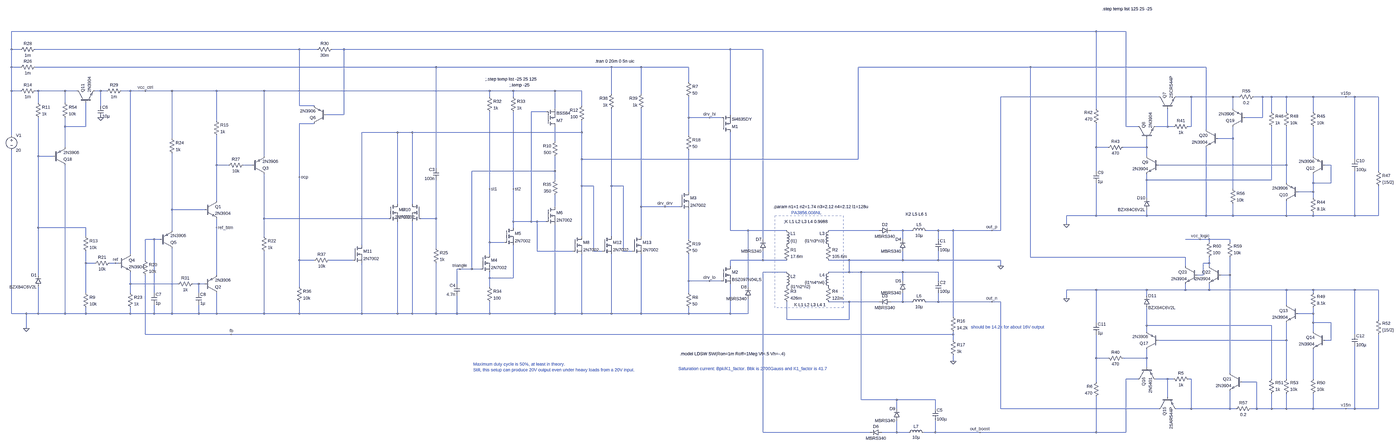
[diagram p0: schematic forward_regulator_1.asc, whole sheet]
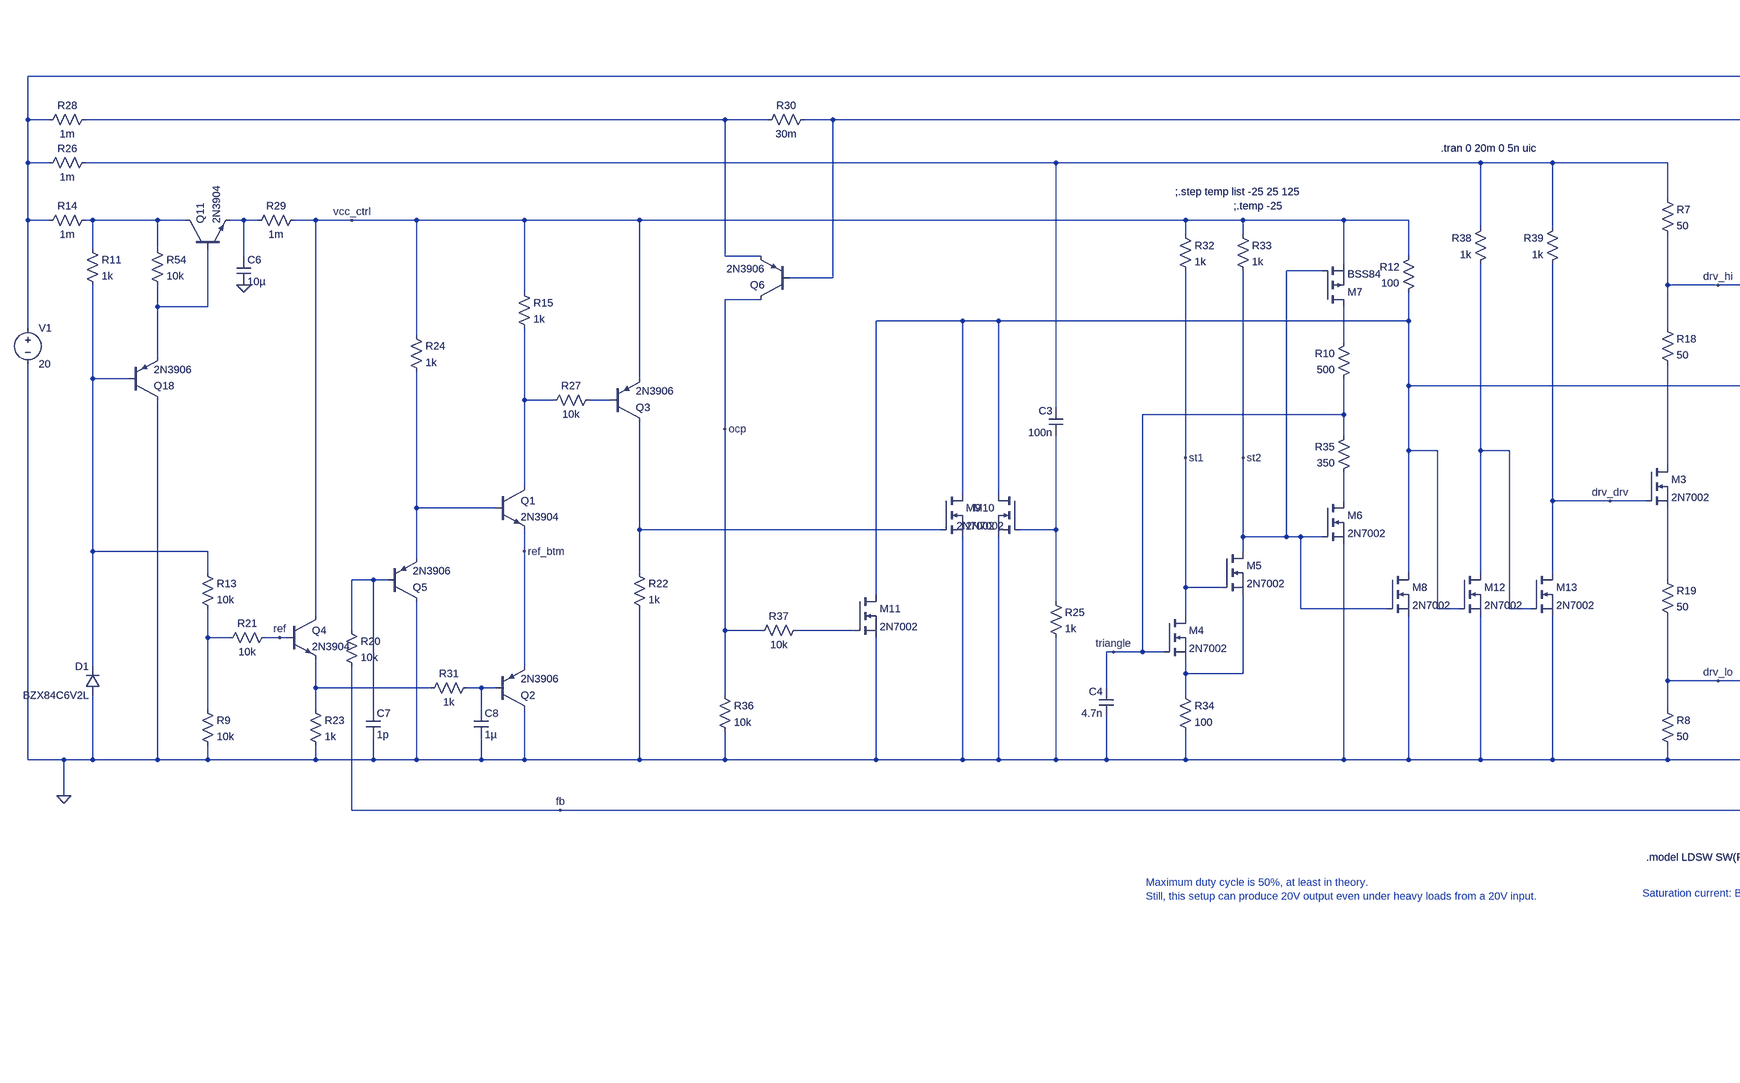
[diagram p1: schematic forward_regulator_1.asc, part, row 1 of 1, column 1 of 2]
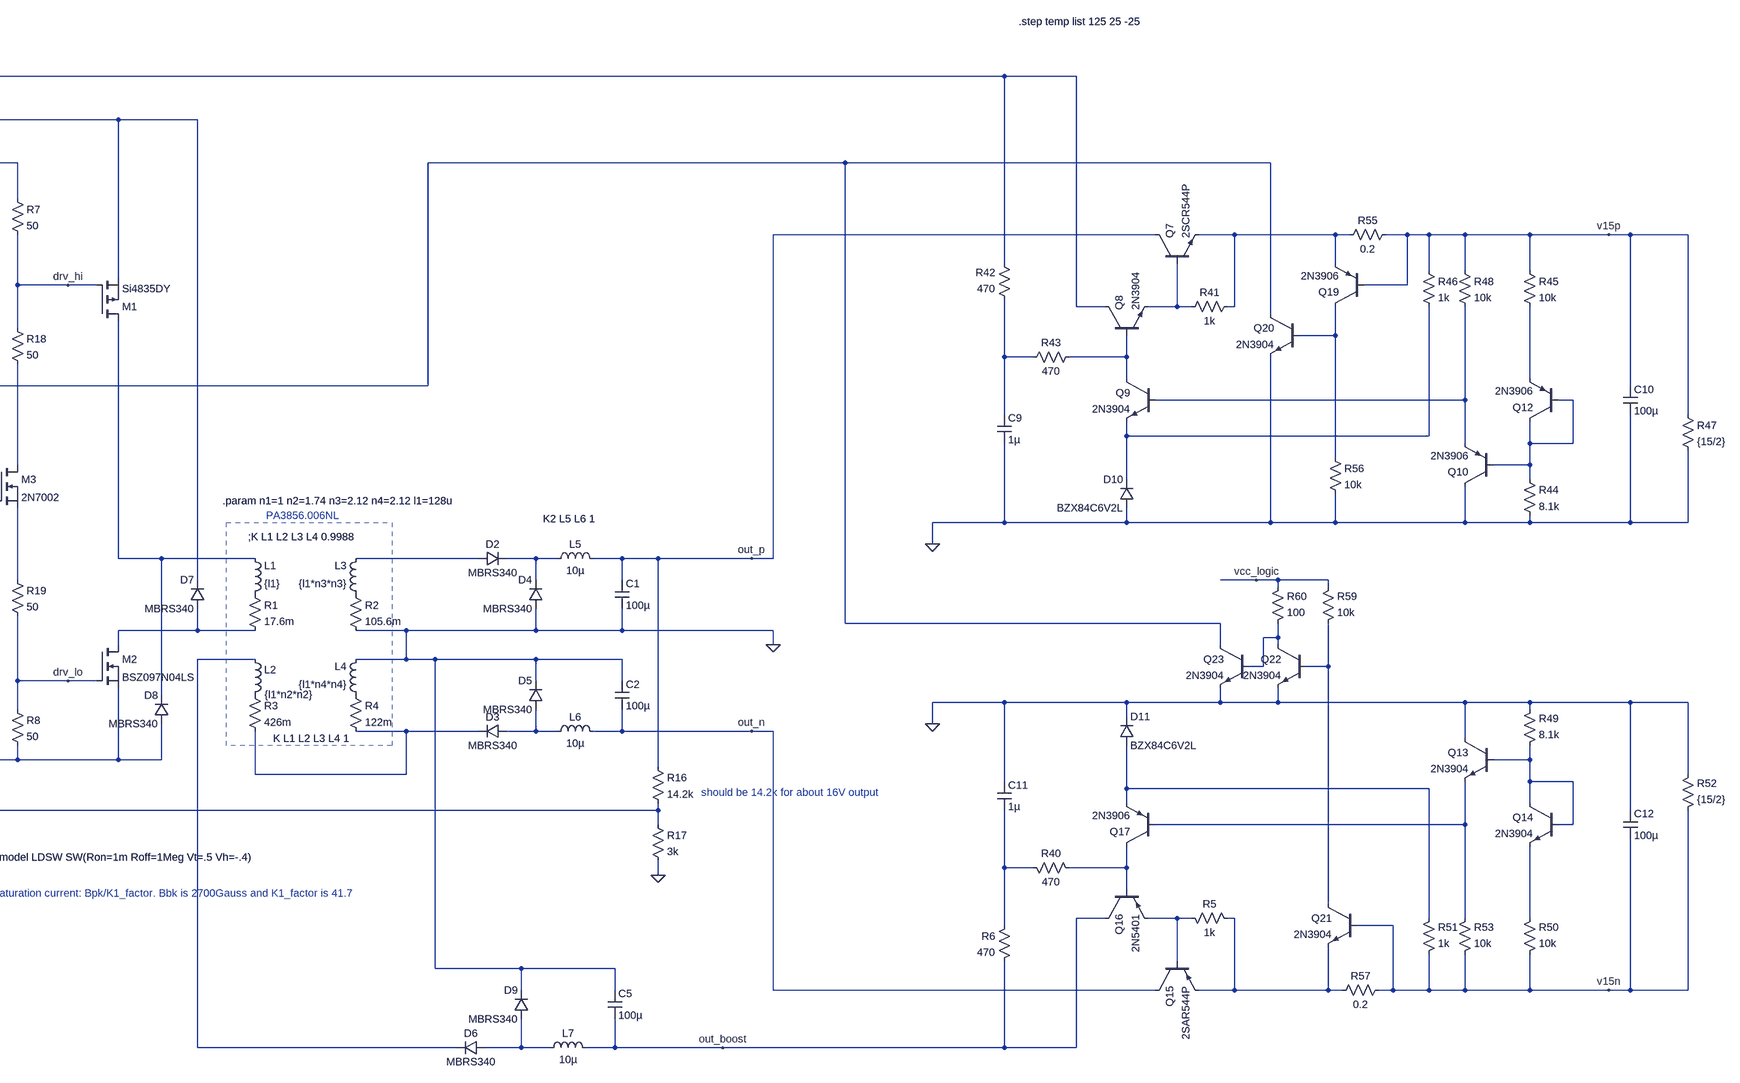
[diagram p2: schematic forward_regulator_1.asc, part, row 1 of 1, column 2 of 2]
forward_regulator_1.asc, the LTspice schematic file:
Version 4.1
SHEET 1 3684 2756
WIRE 1920 -976 -4080 -976
WIRE 2080 -976 1920 -976
WIRE -4080 -880 -4080 -976
WIRE -4032 -880 -4080 -880
WIRE -2480 -880 -3952 -880
WIRE -2384 -880 -2480 -880
WIRE -2240 -880 -2304 -880
WIRE -160 -880 -2240 -880
WIRE 16 -880 -160 -880
WIRE -4080 -784 -4080 -880
WIRE -4032 -784 -4080 -784
WIRE -1744 -784 -3952 -784
WIRE -800 -784 -1744 -784
WIRE -640 -784 -800 -784
WIRE -384 -784 -640 -784
WIRE 1456 -784 528 -784
WIRE 2512 -784 1456 -784
WIRE -384 -704 -384 -784
WIRE -4080 -656 -4080 -784
WIRE -4032 -656 -4080 -656
WIRE -3936 -656 -3952 -656
WIRE -3792 -656 -3936 -656
WIRE -3728 -656 -3792 -656
WIRE -3600 -656 -3632 -656
WIRE -3568 -656 -3600 -656
WIRE -3440 -656 -3488 -656
WIRE -3360 -656 -3440 -656
WIRE -3216 -656 -3360 -656
WIRE -2976 -656 -3216 -656
WIRE -2720 -656 -2976 -656
WIRE -1456 -656 -2720 -656
WIRE -1328 -656 -1456 -656
WIRE -1104 -656 -1328 -656
WIRE -960 -656 -1104 -656
WIRE -800 -640 -800 -784
WIRE -640 -640 -640 -784
WIRE -1456 -624 -1456 -656
WIRE -1328 -624 -1328 -656
WIRE 2256 -624 1296 -624
WIRE 2432 -624 2352 -624
WIRE 2656 -624 2432 -624
WIRE 2688 -624 2656 -624
WIRE 2816 -624 2768 -624
WIRE 2864 -624 2816 -624
WIRE 2944 -624 2864 -624
WIRE 3088 -624 2944 -624
WIRE 3264 -624 3088 -624
WIRE 3312 -624 3264 -624
WIRE 3440 -624 3312 -624
WIRE -3936 -592 -3936 -656
WIRE -3792 -592 -3792 -656
WIRE -3600 -576 -3600 -656
WIRE -2480 -576 -2480 -880
WIRE -2400 -576 -2480 -576
WIRE -960 -576 -960 -656
WIRE -1104 -560 -1104 -656
WIRE 1920 -560 1920 -976
WIRE 2656 -560 2656 -624
WIRE -1152 -544 -1232 -544
WIRE 2864 -544 2864 -624
WIRE 2944 -544 2944 -624
WIRE 3088 -544 3088 -624
WIRE -2240 -528 -2240 -880
WIRE -2240 -528 -2336 -528
WIRE -160 -528 -160 -880
WIRE -384 -512 -384 -624
WIRE -272 -512 -384 -512
WIRE -208 -512 -272 -512
WIRE 2816 -512 2816 -624
WIRE 2816 -512 2720 -512
WIRE -2976 -496 -2976 -656
WIRE -2400 -480 -2480 -480
WIRE -3792 -464 -3792 -512
WIRE -3680 -464 -3680 -592
WIRE -3680 -464 -3792 -464
WIRE 2080 -464 2080 -976
WIRE 2144 -464 2080 -464
WIRE 2304 -464 2304 -560
WIRE 2304 -464 2240 -464
WIRE 2336 -464 2304 -464
WIRE 2432 -464 2432 -624
WIRE 2432 -464 2416 -464
WIRE 2512 -448 2512 -784
WIRE -1952 -432 -2144 -432
WIRE -1872 -432 -1952 -432
WIRE -960 -432 -960 -496
WIRE -960 -432 -1872 -432
WIRE -4080 -416 -4080 -656
WIRE -384 -416 -384 -512
WIRE -3216 -400 -3216 -656
WIRE 2656 -400 2656 -464
WIRE 2656 -400 2576 -400
WIRE -1104 -384 -1104 -464
WIRE -3792 -352 -3792 -464
WIRE 1920 -352 1920 -480
WIRE 1984 -352 1920 -352
WIRE 2192 -352 2192 -400
WIRE 2192 -352 2064 -352
WIRE -3936 -304 -3936 -512
WIRE -3856 -304 -3936 -304
WIRE -2720 -304 -2720 -656
WIRE 2192 -304 2192 -352
WIRE 3088 -304 3088 -464
WIRE -960 -288 -960 -432
WIRE 528 -288 528 -784
WIRE 528 -288 -960 -288
WIRE 3312 -288 3312 -624
WIRE -2976 -256 -2976 -416
WIRE -2912 -256 -2976 -256
WIRE -2784 -256 -2832 -256
WIRE 2944 -256 2944 -464
WIRE 2944 -256 2256 -256
WIRE 3184 -256 3152 -256
WIRE -1744 -240 -1744 -784
WIRE -1104 -224 -1104 -304
WIRE -1104 -224 -1552 -224
WIRE 1920 -224 1920 -352
WIRE 3440 -224 3440 -624
WIRE -2480 -192 -2480 -480
WIRE -1104 -176 -1104 -224
WIRE 2192 -176 2192 -208
WIRE 2864 -176 2864 -464
WIRE 2864 -176 2192 -176
WIRE 2944 -160 2944 -256
WIRE 3088 -160 3088 -208
WIRE 3184 -160 3184 -256
WIRE 3184 -160 3088 -160
WIRE -960 -144 -960 -288
WIRE -896 -144 -960 -144
WIRE -800 -144 -800 -560
WIRE -736 -144 -800 -144
WIRE -1456 -128 -1456 -544
WIRE -1328 -128 -1328 -544
WIRE 2656 -128 2656 -400
WIRE -384 -112 -384 -336
WIRE 3088 -112 3088 -160
WIRE 3088 -112 3008 -112
WIRE 2192 -80 2192 -176
WIRE 3088 -80 3088 -112
WIRE -2976 -64 -2976 -256
WIRE -1952 -48 -1952 -432
WIRE -1872 -48 -1872 -432
WIRE -1104 -32 -1104 -96
WIRE -640 -32 -640 -560
WIRE -512 -32 -640 -32
WIRE -432 -32 -512 -32
WIRE -3216 -16 -3216 -320
WIRE -3040 -16 -3216 -16
WIRE 1920 16 1920 -160
WIRE 1920 16 1760 16
WIRE 2192 16 2192 -16
WIRE 2192 16 1920 16
WIRE 2512 16 2512 -352
WIRE 2512 16 2192 16
WIRE 2656 16 2656 -48
WIRE 2656 16 2512 16
WIRE 2944 16 2944 -64
WIRE 2944 16 2656 16
WIRE 3088 16 3088 0
WIRE 3088 16 2944 16
WIRE 3312 16 3312 -224
WIRE 3312 16 3088 16
WIRE 3440 16 3440 -144
WIRE 3440 16 3312 16
WIRE -2720 32 -2720 -208
WIRE -2000 32 -2720 32
WIRE -1744 32 -1744 -176
WIRE -1744 32 -1824 32
WIRE -1328 48 -1328 -128
WIRE -1232 48 -1232 -544
WIRE -1232 48 -1328 48
WIRE -1200 48 -1232 48
WIRE -1152 48 -1200 48
WIRE 1760 64 1760 16
WIRE -3936 80 -3936 -304
WIRE -3680 80 -3936 80
WIRE -2976 80 -2976 32
WIRE -1328 80 -1328 48
WIRE -3216 96 -3216 -16
WIRE -160 96 -160 -432
WIRE -64 96 -160 96
WIRE 144 96 -64 96
WIRE 640 96 368 96
WIRE 768 96 704 96
WIRE 816 96 768 96
WIRE 960 96 896 96
WIRE 1040 96 960 96
WIRE 1248 96 1040 96
WIRE 1296 96 1296 -624
WIRE 1296 96 1248 96
WIRE -3680 128 -3680 80
WIRE -2720 128 -2720 32
WIRE -960 128 -960 -144
WIRE -800 128 -800 -144
WIRE -640 128 -640 -32
WIRE -3312 144 -3360 144
WIRE -3280 144 -3312 144
WIRE -384 144 -384 -16
WIRE 16 144 16 -880
WIRE 768 144 768 96
WIRE 960 144 960 96
WIRE 2480 144 2400 144
WIRE 2528 144 2480 144
WIRE 2640 144 2528 144
WIRE -1456 160 -1456 -128
WIRE -1376 160 -1456 160
WIRE 2528 160 2528 144
WIRE 2640 160 2640 144
WIRE -2144 176 -2144 -432
WIRE -1744 192 -1744 32
WIRE -1200 208 -1200 48
WIRE -1008 208 -1200 208
WIRE -896 208 -896 -144
WIRE -848 208 -896 208
WIRE -736 208 -736 -144
WIRE -688 208 -736 208
WIRE -3440 224 -3440 -656
WIRE -1456 224 -1456 160
WIRE 1456 240 1456 -784
WIRE 2400 240 1456 240
WIRE -3360 256 -3360 144
WIRE -2480 256 -2480 -192
WIRE -2400 256 -2480 256
WIRE -2192 256 -2320 256
WIRE 16 256 16 208
WIRE 16 256 -160 256
WIRE 144 256 16 256
WIRE 480 256 368 256
WIRE 768 256 768 208
WIRE 768 256 480 256
WIRE 960 256 960 208
WIRE 960 256 768 256
WIRE 1296 256 960 256
WIRE -3680 272 -3680 208
WIRE -3632 272 -3680 272
WIRE -3520 272 -3552 272
WIRE -3504 272 -3520 272
WIRE 2528 272 2528 240
WIRE 2528 272 2496 272
WIRE -160 288 -160 256
WIRE 1296 288 1296 256
WIRE 2400 288 2400 240
WIRE 2528 288 2528 272
WIRE -1616 304 -1632 304
WIRE -1552 304 -1552 -224
WIRE -1552 304 -1616 304
WIRE -1504 304 -1552 304
WIRE 144 320 16 320
WIRE 480 320 480 256
WIRE 480 320 368 320
WIRE 544 320 480 320
WIRE 768 320 544 320
WIRE 960 320 768 320
WIRE -3936 336 -3936 80
WIRE -2976 336 -2976 80
WIRE 2496 336 2496 272
WIRE 2496 336 2464 336
WIRE 2640 336 2640 240
WIRE 2640 336 2592 336
WIRE -1456 352 -1456 320
WIRE -1328 352 -1328 176
WIRE -1328 352 -1456 352
WIRE -384 368 -384 224
WIRE -272 368 -384 368
WIRE -208 368 -272 368
WIRE 768 368 768 320
WIRE 960 368 960 320
WIRE -3440 384 -3440 320
WIRE -3184 384 -3440 384
WIRE -3072 384 -3104 384
WIRE -3040 384 -3072 384
WIRE -1632 384 -1632 304
WIRE -2480 400 -2480 256
WIRE -1456 400 -1456 352
WIRE -64 400 -64 96
WIRE 1920 416 1760 416
WIRE 2192 416 1920 416
WIRE 2400 416 2400 384
WIRE 2400 416 2192 416
WIRE 2528 416 2528 384
WIRE 2528 416 2400 416
WIRE 2944 416 2528 416
WIRE 3088 416 2944 416
WIRE 3312 416 3088 416
WIRE 3440 416 3312 416
WIRE -3680 432 -3680 272
WIRE -3440 432 -3440 384
WIRE -3312 432 -3312 144
WIRE -3072 432 -3072 384
WIRE -384 432 -384 368
WIRE 3088 432 3088 416
WIRE 2192 448 2192 416
WIRE 1760 464 1760 416
WIRE 480 480 368 480
WIRE 640 480 480 480
WIRE 768 480 768 432
WIRE 768 480 704 480
WIRE 816 480 768 480
WIRE 960 480 960 432
WIRE 960 480 896 480
WIRE 1248 480 960 480
WIRE 1296 480 1248 480
WIRE 2944 496 2944 416
WIRE -4080 544 -4080 -336
WIRE -4000 544 -4080 544
WIRE -3936 544 -3936 400
WIRE -3936 544 -4000 544
WIRE -3792 544 -3792 -256
WIRE -3792 544 -3936 544
WIRE -3680 544 -3680 512
WIRE -3680 544 -3792 544
WIRE -3440 544 -3440 512
WIRE -3440 544 -3680 544
WIRE -3312 544 -3312 496
WIRE -3312 544 -3440 544
WIRE -3216 544 -3216 192
WIRE -3216 544 -3312 544
WIRE -3072 544 -3072 496
WIRE -3072 544 -3216 544
WIRE -2976 544 -2976 432
WIRE -2976 544 -3072 544
WIRE -2720 544 -2720 208
WIRE -2720 544 -2976 544
WIRE -2480 544 -2480 480
WIRE -2480 544 -2720 544
WIRE -2144 544 -2144 272
WIRE -2144 544 -2480 544
WIRE -1952 544 -1952 48
WIRE -1952 544 -2144 544
WIRE -1872 544 -1872 48
WIRE -1872 544 -1952 544
WIRE -1744 544 -1744 272
WIRE -1744 544 -1872 544
WIRE -1632 544 -1632 448
WIRE -1632 544 -1744 544
WIRE -1456 544 -1456 480
WIRE -1456 544 -1632 544
WIRE -1104 544 -1104 64
WIRE -1104 544 -1456 544
WIRE -960 544 -960 224
WIRE -960 544 -1104 544
WIRE -800 544 -800 224
WIRE -800 544 -960 544
WIRE -640 544 -640 224
WIRE -640 544 -800 544
WIRE -384 544 -384 512
WIRE -384 544 -640 544
WIRE -160 544 -160 384
WIRE -160 544 -384 544
WIRE -64 544 -64 464
WIRE -64 544 -160 544
WIRE 3088 544 3088 512
WIRE 3088 544 3008 544
WIRE 1040 560 1040 96
WIRE 144 576 144 480
WIRE 480 576 480 480
WIRE 480 576 144 576
WIRE 3440 576 3440 416
WIRE 1920 592 1920 416
WIRE 3088 592 3088 544
WIRE 3184 592 3088 592
WIRE 2192 608 2192 512
WIRE 2864 608 2192 608
WIRE -4000 624 -4000 544
WIRE 2192 640 2192 608
WIRE 3088 640 3088 592
WIRE -3360 656 -3360 336
WIRE -2896 656 -3360 656
WIRE 1040 656 1040 640
WIRE 1040 656 -2896 656
WIRE 3312 656 3312 416
WIRE 1040 688 1040 656
WIRE 2944 688 2944 592
WIRE 2944 688 2256 688
WIRE 3184 688 3184 592
WIRE 3184 688 3152 688
WIRE 1920 784 1920 656
WIRE 1984 784 1920 784
WIRE 2192 784 2192 736
WIRE 2192 784 2064 784
WIRE 1040 800 1040 768
WIRE 2192 832 2192 784
WIRE 2640 864 2640 336
WIRE 2144 896 2080 896
WIRE 2304 896 2240 896
WIRE 2336 896 2304 896
WIRE 2432 896 2416 896
WIRE 2864 896 2864 608
WIRE 2944 896 2944 688
WIRE 3088 896 3088 736
WIRE 1920 912 1920 784
WIRE 2784 912 2704 912
WIRE 2304 992 2304 896
WIRE 544 1008 544 320
WIRE 736 1008 544 1008
WIRE 944 1008 736 1008
WIRE 736 1056 736 1008
WIRE 944 1056 944 1008
WIRE 1296 1056 1296 480
WIRE 2256 1056 1296 1056
WIRE 2432 1056 2432 896
WIRE 2432 1056 2352 1056
WIRE 2640 1056 2640 960
WIRE 2640 1056 2432 1056
WIRE 2672 1056 2640 1056
WIRE 2784 1056 2784 912
WIRE 2784 1056 2752 1056
WIRE 2864 1056 2864 976
WIRE 2864 1056 2784 1056
WIRE 2944 1056 2944 976
WIRE 2944 1056 2864 1056
WIRE 3088 1056 3088 976
WIRE 3088 1056 2944 1056
WIRE 3264 1056 3088 1056
WIRE 3312 1056 3312 720
WIRE 3312 1056 3264 1056
WIRE 3440 1056 3440 656
WIRE 3440 1056 3312 1056
WIRE 16 1184 16 320
WIRE 592 1184 16 1184
WIRE 736 1184 736 1120
WIRE 736 1184 656 1184
WIRE 800 1184 736 1184
WIRE 944 1184 944 1120
WIRE 944 1184 880 1184
WIRE 1184 1184 944 1184
WIRE 1920 1184 1920 992
WIRE 1920 1184 1184 1184
WIRE 2080 1184 2080 896
WIRE 2080 1184 1920 1184
FLAG 1296 288 0
FLAG 1248 96 out_p
FLAG 1248 480 out_n
FLAG -272 368 drv_lo
FLAG -272 -512 drv_hi
FLAG -1456 -128 st1
FLAG -1328 -128 st2
FLAG -4000 624 0
FLAG -1616 304 triangle
FLAG -512 -32 drv_drv
FLAG 1040 800 0
FLAG -3600 -512 0
FLAG -2896 656 fb
FLAG -3520 272 ref
FLAG -2976 80 ref_btm
FLAG -2480 -192 ocp
FLAG 1184 1184 out_boost
FLAG 1760 64 0
FLAG 3264 -624 v15p
FLAG 1760 464 0
FLAG 3264 1056 v15n
FLAG -3360 -656 vcc_ctrl
FLAG 2480 144 vcc_logic
SYMBOL ind 128 192 M180
WINDOW 0 36 80 Left 2
WINDOW 3 36 40 Left 2
SYMATTR InstName L1
SYMATTR Value {l1}
SYMATTR Type ind
SYMATTR SpiceLine Rser=1m
SYMBOL ind 128 304 R0
WINDOW 3 37 95 Left 2
SYMATTR Value {l1*n2*n2}
SYMATTR InstName L2
SYMATTR Type ind
SYMATTR SpiceLine Rser=1m
SYMBOL ind 384 192 R180
WINDOW 0 36 80 Left 2
WINDOW 3 36 40 Left 2
SYMATTR InstName L3
SYMATTR Value {l1*n3*n3}
SYMATTR Type ind
SYMATTR SpiceLine Rser=1m
SYMBOL ind 384 416 R180
WINDOW 0 36 80 Left 2
WINDOW 3 36 40 Left 2
SYMATTR InstName L4
SYMATTR Value {l1*n4*n4}
SYMATTR Type ind
SYMATTR SpiceLine Rser=1m
SYMBOL res 128 160 R0
SYMATTR InstName R1
SYMATTR Value 17.6m
SYMBOL res 352 160 R0
SYMATTR InstName R2
SYMATTR Value 105.6m
SYMBOL res 128 384 R0
SYMATTR InstName R3
SYMATTR Value 426m
SYMBOL res 352 384 R0
SYMATTR InstName R4
SYMATTR Value 122m
SYMBOL diode 640 112 R270
WINDOW 0 32 32 VTop 2
WINDOW 3 0 32 VBottom 2
SYMATTR InstName D2
SYMATTR Value MBRS340
SYMBOL ind 800 112 R270
WINDOW 0 32 56 VTop 2
WINDOW 3 5 56 VBottom 2
SYMATTR InstName L5
SYMATTR Value 10µ
SYMATTR Type ind
SYMATTR SpiceLine Rser=1m
SYMBOL cap 944 144 R0
SYMATTR InstName C1
SYMATTR Value 100µ
SYMBOL ind 912 496 M270
WINDOW 0 32 56 VTop 2
WINDOW 3 5 56 VBottom 2
SYMATTR InstName L6
SYMATTR Value 10µ
SYMATTR Type ind
SYMATTR SpiceLine Rser=1m
SYMBOL cap 944 368 R0
SYMATTR InstName C2
SYMATTR Value 100µ
SYMBOL diode 704 464 R90
WINDOW 0 0 32 VBottom 2
WINDOW 3 32 32 VTop 2
SYMATTR InstName D3
SYMATTR Value MBRS340
SYMBOL diode 784 208 R180
WINDOW 0 24 64 Left 2
WINDOW 3 24 0 Left 2
SYMATTR InstName D4
SYMATTR Value MBRS340
SYMBOL diode 784 432 R180
WINDOW 0 24 64 Left 2
WINDOW 3 24 0 Left 2
SYMATTR InstName D5
SYMATTR Value MBRS340
SYMBOL res -400 -720 R0
SYMATTR InstName R7
SYMATTR Value 50
SYMBOL res -400 416 R0
SYMATTR InstName R8
SYMATTR Value 50
SYMBOL pmos -208 -432 M180
SYMATTR InstName M1
SYMATTR Value Si4835DY
SYMBOL nmos -208 288 R0
SYMATTR InstName M2
SYMATTR Value BSZ097N04LS
SYMBOL nmos -432 -112 R0
SYMATTR InstName M3
SYMATTR Value 2N7002
SYMBOL res -400 -432 R0
SYMATTR InstName R18
SYMATTR Value 50
SYMBOL res -400 128 R0
SYMATTR InstName R19
SYMATTR Value 50
SYMBOL diode 32 208 R180
WINDOW 0 24 64 Left 2
WINDOW 3 24 0 Left 2
SYMATTR InstName D7
SYMATTR Value MBRS340
SYMBOL diode -48 464 R180
WINDOW 0 24 64 Left 2
WINDOW 3 24 0 Left 2
SYMATTR InstName D8
SYMATTR Value MBRS340
SYMBOL voltage -4080 -432 R0
SYMATTR InstName V1
SYMATTR Value 20
SYMBOL diode -3920 400 R180
WINDOW 0 24 64 Left 2
WINDOW 3 24 0 Left 2
SYMATTR InstName D1
SYMATTR Value BZX84C6V2L
SYMBOL res -3952 -608 R0
SYMATTR InstName R11
SYMATTR Value 1k
SYMBOL res -4048 -640 R270
WINDOW 0 32 56 VTop 2
WINDOW 3 0 56 VBottom 2
SYMATTR InstName R14
SYMATTR Value 1m
SYMBOL npn -3728 -592 R270
SYMATTR InstName Q11
SYMATTR Value 2N3904
SYMBOL cap -1728 -240 M0
SYMATTR InstName C3
SYMATTR Value 100n
SYMBOL res -3472 -672 R90
WINDOW 0 0 56 VBottom 2
WINDOW 3 32 56 VTop 2
SYMATTR InstName R29
SYMATTR Value 1m
SYMBOL nmos -1504 224 R0
SYMATTR InstName M4
SYMATTR Value 2N7002
SYMBOL nmos -1376 80 R0
SYMATTR InstName M5
SYMATTR Value 2N7002
SYMBOL res -1472 -640 R0
SYMATTR InstName R32
SYMATTR Value 1k
SYMBOL res -1344 -640 R0
SYMATTR InstName R33
SYMATTR Value 1k
SYMBOL res -1472 384 R0
SYMATTR InstName R34
SYMATTR Value 100
SYMBOL nmos -1152 -32 R0
SYMATTR InstName M6
SYMATTR Value 2N7002
SYMBOL pmos -1152 -464 M180
SYMATTR InstName M7
SYMATTR Value BSS84
SYMBOL cap -1616 384 M0
SYMATTR InstName C4
SYMATTR Value 4.7n
SYMBOL res -1088 -192 M0
SYMATTR InstName R35
SYMATTR Value 350
SYMBOL res -1088 -400 M0
SYMATTR InstName R10
SYMATTR Value 500
SYMBOL nmos -1008 128 R0
SYMATTR InstName M8
SYMATTR Value 2N7002
SYMBOL res -944 -592 M0
SYMATTR InstName R12
SYMATTR Value 100
SYMBOL npn -3040 -64 R0
SYMATTR InstName Q1
SYMATTR Value 2N3904
SYMBOL pnp -3040 432 M180
SYMATTR InstName Q2
SYMATTR Value 2N3906
SYMBOL res -3696 416 R0
SYMATTR InstName R9
SYMATTR Value 10k
SYMBOL res -3696 112 R0
SYMATTR InstName R13
SYMATTR Value 10k
SYMBOL res -2992 -512 R0
SYMATTR InstName R15
SYMATTR Value 1k
SYMBOL res 1024 544 R0
SYMATTR InstName R16
SYMATTR Value 14.2k
SYMBOL res 1024 672 R0
SYMATTR InstName R17
SYMATTR Value 3k
SYMBOL res -3376 240 R0
SYMATTR InstName R20
SYMATTR Value 10k
SYMBOL res -3536 256 R90
WINDOW 0 0 56 VBottom 2
WINDOW 3 32 56 VTop 2
SYMATTR InstName R21
SYMATTR Value 10k
SYMBOL pnp -2784 -208 M180
SYMATTR InstName Q3
SYMATTR Value 2N3906
SYMBOL res -2736 112 R0
SYMATTR InstName R22
SYMATTR Value 1k
SYMBOL nmos -2000 -48 R0
SYMATTR InstName M9
SYMATTR Value 2N7002
SYMBOL npn -3504 224 R0
SYMATTR InstName Q4
SYMATTR Value 2N3904
SYMBOL res -3456 416 R0
SYMATTR InstName R23
SYMATTR Value 1k
SYMBOL res -3232 -416 R0
SYMATTR InstName R24
SYMATTR Value 1k
SYMBOL nmos -1824 -48 M0
SYMATTR InstName M10
SYMATTR Value 2N7002
SYMBOL res -1760 176 R0
SYMATTR InstName R25
SYMATTR Value 1k
SYMBOL cap -3616 -576 R0
SYMATTR InstName C6
SYMATTR Value 10µ
SYMBOL res -2816 -272 R90
WINDOW 0 0 56 VBottom 2
WINDOW 3 32 56 VTop 2
SYMATTR InstName R27
SYMATTR Value 10k
SYMBOL cap -3328 432 R0
SYMATTR InstName C7
SYMATTR Value 1p
SYMBOL pnp -3280 192 M180
SYMATTR InstName Q5
SYMATTR Value 2N3906
SYMBOL cap -3088 432 R0
SYMATTR InstName C8
SYMATTR Value 1µ
SYMBOL res -3088 368 R90
WINDOW 0 0 56 VBottom 2
WINDOW 3 32 56 VTop 2
SYMATTR InstName R31
SYMATTR Value 1k
SYMBOL res -4048 -768 R270
WINDOW 0 32 56 VTop 2
WINDOW 3 0 56 VBottom 2
SYMATTR InstName R26
SYMATTR Value 1m
SYMBOL res -4048 -864 R270
WINDOW 0 32 56 VTop 2
WINDOW 3 0 56 VBottom 2
SYMATTR InstName R28
SYMATTR Value 1m
SYMBOL res -2400 -864 R270
WINDOW 0 32 56 VTop 2
WINDOW 3 0 56 VBottom 2
SYMATTR InstName R30
SYMATTR Value 30m
SYMBOL pnp -2336 -480 R180
SYMATTR InstName Q6
SYMATTR Value 2N3906
SYMBOL res -2496 384 R0
SYMATTR InstName R36
SYMATTR Value 10k
SYMBOL nmos -2192 176 R0
SYMATTR InstName M11
SYMATTR Value 2N7002
SYMBOL res -2304 240 R90
WINDOW 0 0 56 VBottom 2
WINDOW 3 32 56 VTop 2
SYMATTR InstName R37
SYMATTR Value 10k
SYMBOL nmos -848 128 R0
SYMATTR InstName M12
SYMATTR Value 2N7002
SYMBOL res -784 -656 M0
SYMATTR InstName R38
SYMATTR Value 1k
SYMBOL nmos -688 128 R0
SYMATTR InstName M13
SYMATTR Value 2N7002
SYMBOL res -624 -656 M0
SYMATTR InstName R39
SYMATTR Value 1k
SYMBOL diode 656 1168 R90
WINDOW 0 0 32 VBottom 2
WINDOW 3 32 32 VTop 2
SYMATTR InstName D6
SYMATTR Value MBRS340
SYMBOL ind 896 1200 M270
WINDOW 0 32 56 VTop 2
WINDOW 3 5 56 VBottom 2
SYMATTR InstName L7
SYMATTR Value 10µ
SYMATTR SpiceLine Rser=1m
SYMBOL diode 752 1120 R180
WINDOW 0 24 64 Left 2
WINDOW 3 24 0 Left 2
SYMATTR InstName D9
SYMATTR Value MBRS340
SYMBOL cap 928 1056 R0
SYMATTR InstName C5
SYMATTR Value 100µ
SYMBOL npn 2256 -560 R270
SYMATTR InstName Q7
SYMATTR Value 2SCR544P
SYMBOL npn 2144 -400 R270
SYMATTR InstName Q8
SYMATTR Value 2N3904
SYMBOL npn 2256 -304 M0
SYMATTR InstName Q9
SYMATTR Value 2N3904
SYMBOL res 2432 -480 R90
WINDOW 0 0 56 VBottom 2
WINDOW 3 32 56 VTop 2
SYMATTR InstName R41
SYMATTR Value 1k
SYMBOL res 1936 -464 R180
WINDOW 0 36 76 Left 2
WINDOW 3 36 40 Left 2
SYMATTR InstName R42
SYMATTR Value 470
SYMBOL res 1968 -336 R270
WINDOW 0 32 56 VTop 2
WINDOW 3 0 56 VBottom 2
SYMATTR InstName R43
SYMATTR Value 470
SYMBOL res 3072 -96 R0
SYMATTR InstName R44
SYMATTR Value 8.1k
SYMBOL res 3072 -560 R0
SYMATTR InstName R45
SYMATTR Value 10k
SYMBOL res 2848 -560 R0
SYMATTR InstName R46
SYMATTR Value 1k
SYMBOL diode 2208 -16 R180
WINDOW 0 24 64 Left 2
WINDOW 3 24 0 Left 2
SYMATTR InstName D10
SYMATTR Value BZX84C6V2L
SYMBOL cap 1904 -224 R0
SYMATTR InstName C9
SYMATTR Value 1µ
SYMBOL cap 3296 -288 R0
SYMATTR InstName C10
SYMATTR Value 100µ
SYMBOL res 3424 -240 R0
SYMATTR InstName R47
SYMATTR Value {15/2}
SYMBOL pnp 3008 -64 R180
SYMATTR InstName Q10
SYMATTR Value 2N3906
SYMBOL res 2928 -560 R0
SYMATTR InstName R48
SYMATTR Value 10k
SYMBOL pnp 3152 -208 R180
SYMATTR InstName Q12
SYMATTR Value 2N3906
SYMBOL npn 3008 496 M0
SYMATTR InstName Q13
SYMATTR Value 2N3904
SYMBOL npn 3152 640 M0
SYMATTR InstName Q14
SYMATTR Value 2N3904
SYMBOL res 2432 912 M270
WINDOW 0 32 56 VTop 2
WINDOW 3 0 56 VBottom 2
SYMATTR InstName R5
SYMATTR Value 1k
SYMBOL res 1936 896 M0
SYMATTR InstName R6
SYMATTR Value 470
SYMBOL res 1968 768 M90
WINDOW 0 0 56 VBottom 2
WINDOW 3 32 56 VTop 2
SYMATTR InstName R40
SYMATTR Value 470
SYMBOL res 3072 528 M180
WINDOW 0 36 76 Left 2
WINDOW 3 36 40 Left 2
SYMATTR InstName R49
SYMATTR Value 8.1k
SYMBOL res 3072 992 M180
WINDOW 0 36 76 Left 2
WINDOW 3 36 40 Left 2
SYMATTR InstName R50
SYMATTR Value 10k
SYMBOL res 2848 992 M180
WINDOW 0 36 76 Left 2
WINDOW 3 36 40 Left 2
SYMATTR InstName R51
SYMATTR Value 1k
SYMBOL diode 2176 512 M180
WINDOW 0 24 64 Left 2
WINDOW 3 24 0 Left 2
SYMATTR InstName D11
SYMATTR Value BZX84C6V2L
SYMBOL cap 1904 656 M180
WINDOW 0 24 56 Left 2
WINDOW 3 24 8 Left 2
SYMATTR InstName C11
SYMATTR Value 1µ
SYMBOL cap 3296 720 M180
WINDOW 0 24 56 Left 2
WINDOW 3 24 8 Left 2
SYMATTR InstName C12
SYMATTR Value 100µ
SYMBOL res 3424 672 M180
WINDOW 0 36 76 Left 2
WINDOW 3 36 40 Left 2
SYMATTR InstName R52
SYMATTR Value {15/2}
SYMBOL pnp 2256 992 M90
SYMATTR InstName Q15
SYMATTR Value 2SAR544P
SYMBOL res 2928 992 M180
WINDOW 0 36 76 Left 2
WINDOW 3 36 40 Left 2
SYMATTR InstName R53
SYMATTR Value 10k
SYMBOL pnp 2144 832 M90
SYMATTR InstName Q16
SYMATTR Value 2N5401
SYMBOL pnp 2256 736 R180
SYMATTR InstName Q17
SYMATTR Value 2N3906
SYMBOL pnp -3856 -256 M180
SYMATTR InstName Q18
SYMATTR Value 2N3906
SYMBOL res -3808 -608 R0
SYMATTR InstName R54
SYMATTR Value 10k
SYMBOL res 2784 -640 R90
WINDOW 0 0 56 VBottom 2
WINDOW 3 32 56 VTop 2
SYMATTR InstName R55
SYMATTR Value 0.2
SYMBOL pnp 2720 -464 R180
SYMATTR InstName Q19
SYMATTR Value 2N3906
SYMBOL res 2640 -144 R0
SYMATTR InstName R56
SYMATTR Value 10k
SYMBOL npn 2576 -448 M0
SYMATTR InstName Q20
SYMATTR Value 2N3904
SYMBOL res 2768 1040 R90
WINDOW 0 0 56 VBottom 2
WINDOW 3 32 56 VTop 2
SYMATTR InstName R57
SYMATTR Value 0.2
SYMBOL npn 2704 864 M0
SYMATTR InstName Q21
SYMATTR Value 2N3904
SYMBOL res 2624 256 M180
WINDOW 0 36 76 Left 2
WINDOW 3 36 40 Left 2
SYMATTR InstName R59
SYMATTR Value 10k
SYMBOL res 2512 256 M180
WINDOW 0 36 76 Left 2
WINDOW 3 36 40 Left 2
SYMATTR InstName R60
SYMATTR Value 100
SYMBOL npn 2592 288 M0
SYMATTR InstName Q22
SYMATTR Value 2N3904
SYMBOL npn 2464 288 M0
SYMATTR InstName Q23
SYMATTR Value 2N3904
TEXT 128 48 Left 2 !;K L1 L2 L3 L4 0.9988
TEXT 168 0 Left 2 ;PA3856.006NL
TEXT -432 760 Left 2 !.model LDSW SW(Ron=1m Roff=1Meg Vt=.5 Vh=-.4)
TEXT -888 -816 Left 2 !.tran 0 20m 0 5n uic
TEXT 184 496 Left 2 !K L1 L2 L3 L4 1
TEXT 72 -32 Left 2 !.param n1=1 n2=1.74 n3=2.12 n4=2.12 l1=128u
TEXT -1544 816 Left 2 ;Maximum duty cycle is 50%, at least in theory.\nStill, this setup can produce 20V output even under heavy loads from a 20V input.
TEXT -440 840 Left 2 ;Saturation current: Bpk/K1_factor. Bbk is 2700Gauss and K1_factor is 41.7
TEXT 784 8 Left 2 !K2 L5 L6 1
TEXT -1200 -720 Right 2 !;.step temp list -25 25 125
TEXT -1240 -688 Right 2 !;.temp -25
TEXT 1136 616 Left 2 ;should be 14.2k for about 16V output
TEXT 1952 -1120 Left 2 !.step temp list 125 25 -25
RECTANGLE Normal 448 512 80 16 2

The netlist it stands for:
* forward_regulator_1.asc
L1 P001 N028 {l1} Rser=1m
L2 N037 P002 {l1*n2*n2} Rser=1m
L3 P003 N029 {l1*n3*n3} Rser=1m
L4 P004 0 {l1*n4*n4} Rser=1m
R1 P001 N034 17.6m
R2 P003 0 105.6m
R3 P002 N042 426m
R4 P004 N042 122m
D2 N029 N030 MBRS340
L5 N030 out_p 10µ Rser=1m
C1 out_p 0 100µ
L6 out_n N043 10µ Rser=1m
C2 0 out_n 100µ
D3 N043 N042 MBRS340
D4 0 N030 MBRS340
D5 N043 0 MBRS340
R7 N004 drv_hi 50
R8 drv_lo 0 50
M1 N028 drv_hi N003 N003 Si4835DY
M2 N034 drv_lo 0 0 BSZ097N04LS
M3 N023 drv_drv N032 N032 2N7002
R18 drv_hi N023 50
R19 N032 drv_lo 50
D7 N034 N003 MBRS340
D8 0 N028 MBRS340
V1 N001 0 20
D1 0 N015 BZX84C6V2L
R11 N006 N015 1k
R14 N001 N006 1m
Q11 N006 N009 N007 0 2N3904
C3 N004 N027 100n
R29 vcc_ctrl N007 1m
M4 st1 triangle N039 N039 2N7002
M5 st2 st1 N039 N039 2N7002
R32 vcc_ctrl st1 1k
R33 vcc_ctrl st2 1k
R34 N039 0 100
M6 N024 st2 0 0 2N7002
M7 N012 st2 vcc_ctrl vcc_ctrl BSS84
C4 triangle 0 4.7n
R35 triangle N024 350
R10 N012 triangle 500
M8 N005 st2 0 0 2N7002
R12 vcc_ctrl N005 100
Q1 N017 N025 ref_btm 0 2N3904
Q2 0 N041 ref_btm 0 2N3906
R9 N035 0 10k
R13 N015 N035 10k
R15 vcc_ctrl N017 1k
R16 out_p fb 14.2k
R17 fb 0 3k
R20 N031 fb 10k
R21 ref N035 10k
Q3 N026 N018 vcc_ctrl 0 2N3906
R22 N026 0 1k
M9 N005 N026 0 0 2N7002
Q4 vcc_ctrl ref N040 0 2N3904
R23 N040 0 1k
R24 vcc_ctrl N025 1k
M10 N005 N027 0 0 2N7002
R25 N027 0 1k
C6 N007 0 10µ
R27 N018 N017 10k
C7 N031 0 1p
Q5 0 N031 N025 0 2N3906
C8 N041 0 1µ
R31 N041 N040 1k
R26 N001 N004 1m
R28 N001 N002 1m
R30 N002 N003 30m
Q6 ocp N003 N002 0 2N3906
R36 ocp 0 10k
M11 N005 N033 0 0 2N7002
R37 N033 ocp 10k
M12 N022 N005 0 0 2N7002
R38 N004 N022 1k
M13 drv_drv N022 0 0 2N7002
R39 N004 drv_drv 1k
D6 N052 N037 MBRS340
L7 out_boost N052 10µ Rser=1m
D9 N052 0 MBRS340
C5 0 out_boost 100µ
Q7 out_p N010 N008 0 2SCR544P
Q8 N001 N014 N010 0 2N3904
Q9 N014 N019 N021 0 2N3904
R41 N008 N010 1k
R42 N013 N001 470
R43 N013 N014 470
R44 N020 0 8.1k
R45 v15p N016 10k
R46 v15p N021 1k
D10 0 N021 BZX84C6V2L
C9 N013 0 1µ
C10 v15p 0 100µ
R47 v15p 0 {15/2}
Q10 0 N020 N019 0 2N3906
R48 v15p N019 10k
Q12 N020 N020 N016 0 2N3906
Q13 0 N044 N046 0 2N3904
Q14 N044 N044 N051 0 2N3904
R5 N050 N049 1k
R6 N047 out_boost 470
R40 N047 N048 470
R49 N044 0 8.1k
R50 v15n N051 10k
R51 v15n N045 1k
D11 N045 0 BZX84C6V2L
C11 N047 0 1µ
C12 v15n 0 100µ
R52 v15n 0 {15/2}
Q15 out_n N049 N050 0 2SAR544P
R53 v15n N046 10k
Q16 out_boost N048 N049 0 2N5401
Q17 N048 N046 N045 0 2N3906
Q18 0 N015 N009 0 2N3906
R54 N006 N009 10k
R55 v15p N008 0.2
Q19 N011 v15p N008 0 2N3906
R56 N011 0 10k
Q20 N005 N011 0 0 2N3904
R57 v15n N050 0.2
Q21 N038 v15n N050 0 2N3904
R59 N038 vcc_logic 10k
R60 N036 vcc_logic 100
Q22 N036 N038 0 0 2N3904
Q23 N005 N036 0 0 2N3904
.model D D
.lib standard.dio
.model NPN NPN
.model PNP PNP
.lib standard.bjt
.model NMOS NMOS
.model PMOS PMOS
.lib standard.mos
;K L1 L2 L3 L4 0.9988
* PA3856.006NL
.model LDSW SW(Ron=1m Roff=1Meg Vt=.5 Vh=-.4)
.tran 0 20m 0 5n uic
K L1 L2 L3 L4 1
.param n1=1 n2=1.74 n3=2.12 n4=2.12 l1=128u
* Maximum duty cycle is 50%, at least in theory.
* Still, this setup can produce 20V output even under heavy loads from a 20V input.
* Saturation current: Bpk/K1_factor. Bbk is 2700Gauss and K1_factor is 41.7
K2 L5 L6 1
;.step temp list -25 25 125
;.temp -25
* should be 14.2k for about 16V output
.step temp list 125 25 -25
.backanno
.end